# Altium schematic sheet 05_FPGA_HVIO.SchDoc
size A3; DocumentNumber: 5; SheetNumber: 5; SheetTotal: 21
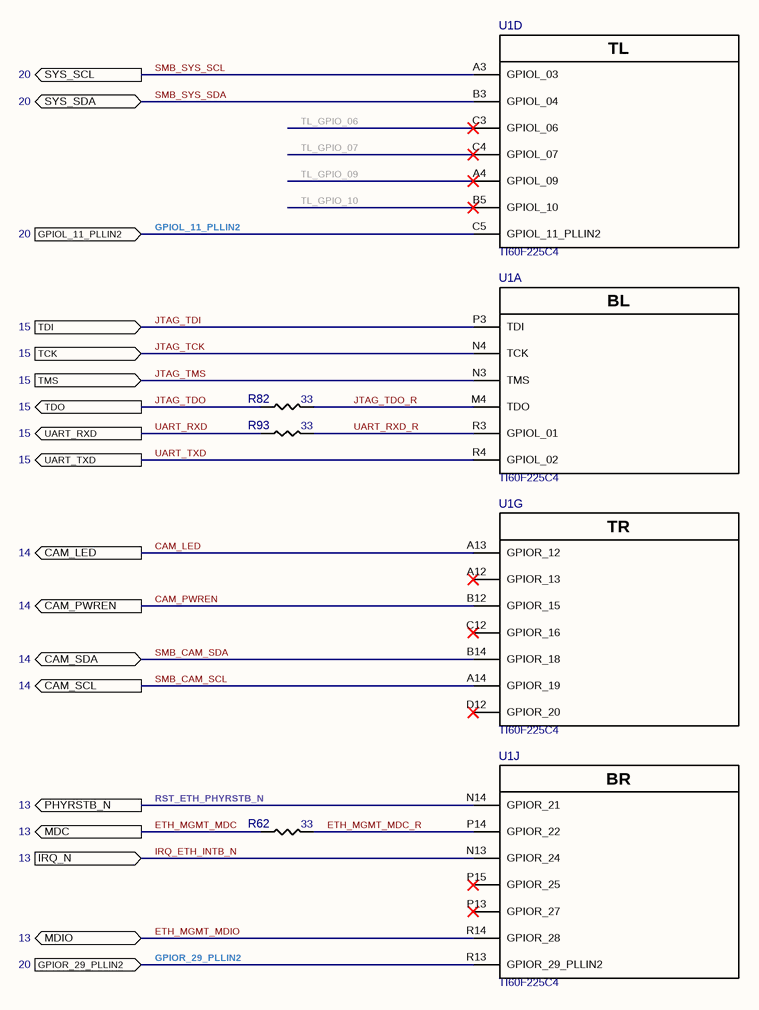
[diagram p0: 05_FPGA_HVIO.SchDoc]

## Parts
R62  33  [RESC1005X03N]
R82  33  [RESC1005X03N]
R93  33  [RESC1005X03N]
U1  TI60F225C4  [BGA225C65P15X15_1000X1000X100]  (parts A,D,G,J of 13)

## Ports
CAM_LED (out, see 14), CAM_PWREN (out, see 14), CAM_SCL (out, see 14), CAM_SDA (bidir, see 14), GPIOL_11_PLLIN2 (in, see 20), GPIOR_29_PLLIN2 (in, see 20), IRQ_N (in, see 13), MDC (out, see 13), MDIO (bidir, see 13), PHYRSTB_N (out, see 13), SYS_SCL (out, see 20), SYS_SDA (bidir, see 20), TCK (in, see 15), TDI (in, see 15), TDO (out, see 15), TMS (in, see 15), UART_RXD (out, see 15), UART_TXD (out, see 15)

## Nets
CAM_LED: U1.A13(GPIOR_12) ; port CAM_LED
CAM_PWREN: U1.B12(GPIOR_15) ; port CAM_PWREN
ETH_MGMT_MDC: R62.1 ; port MDC
ETH_MGMT_MDC_R: R62.2 U1.P14(GPIOR_22)
ETH_MGMT_MDIO: U1.R14(GPIOR_28) ; port MDIO
GPIOL_11_PLLIN2: U1.C5(GPIOL_11_PLLIN2) ; port GPIOL_11_PLLIN2
GPIOR_29_PLLIN2: U1.R13(GPIOR_29_PLLIN2) ; port GPIOR_29_PLLIN2
IRQ_ETH_INTB_N: U1.N13(GPIOR_24) ; port IRQ_N
JTAG_TCK: U1.N4(TCK) ; port TCK
JTAG_TDI: U1.P3(TDI) ; port TDI
JTAG_TDO: R82.1 ; port TDO
JTAG_TDO_R: R82.2 U1.M4(TDO)
JTAG_TMS: U1.N3(TMS) ; port TMS
RST_ETH_PHYRSTB_N: U1.N14(GPIOR_21) ; port PHYRSTB_N
SMB_CAM_SCL: U1.A14(GPIOR_19) ; port CAM_SCL
SMB_CAM_SDA: U1.B14(GPIOR_18) ; port CAM_SDA
SMB_SYS_SCL: U1.A3(GPIOL_03) ; port SYS_SCL
SMB_SYS_SDA: U1.B3(GPIOL_04) ; port SYS_SDA
TL_GPIO_06: U1.C3(GPIOL_06)
TL_GPIO_07: U1.C4(GPIOL_07)
TL_GPIO_09: U1.A4(GPIOL_09)
TL_GPIO_10: U1.B5(GPIOL_10)
UART_RXD: R93.1 ; port UART_RXD
UART_RXD_R: R93.2 U1.R3(GPIOL_01)
UART_TXD: U1.R4(GPIOL_02) ; port UART_TXD

Not connected (* = marked no-connect by the designer): U1 A12(GPIOR_13)* C12(GPIOR_16)* D12(GPIOR_20)* P13(GPIOR_27)* P15(GPIOR_25)*

## Notes on the sheet
- (in symbol TI60F225C4, part A) BL
- (in symbol TI60F225C4, part D) TL
- (in symbol TI60F225C4, part G) TR
- (in symbol TI60F225C4, part J) BR

## Library data of the parts
R62 R82 R93 = RC0402FR-0733RL: RES SMD 33 OHM 1% 1/16W 0402; Manufacturer 1: Yageo; Part Number: RC0402FR-0733RL; Value: 33; Tol: 1%; Manufacturer Part Number 1: RC0402FR-0733RL; Supplier 1: Digi-Key; Supplier Part Number 1: 311-33.0LRCT-ND
U1 = TI60F225C4: FPGA TITAN 140HSIO 4PLL 225BGA; Manufacturer 1: Efinix, Inc.; Part Number: TI60F225C4; Manufacturer Part Number 1: TI60F225C4; Supplier 1: Digi-Key; Supplier Part Number 1: 2134-TI60F225C4-ND